# EAGLE design ATmega128 (EAGLE 5.01)
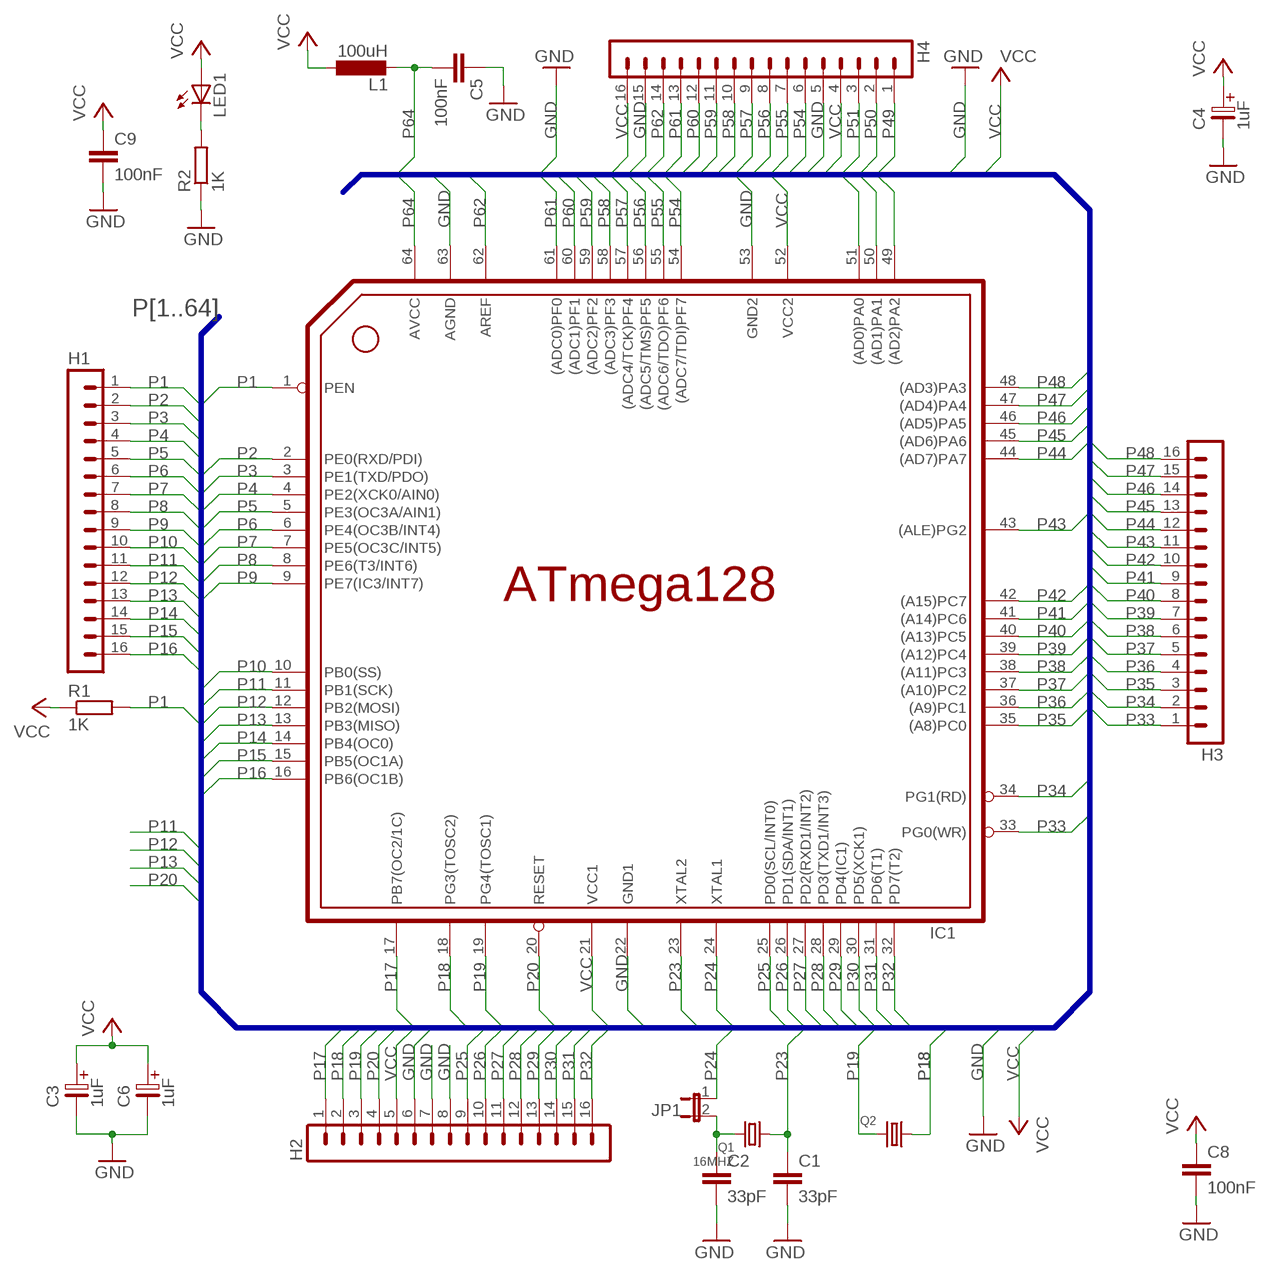
[diagram p0: schematic, sheet 1]

## Parts
C1  33pF  CAP2.5  [CAP2.5]
C2  33pF  CAP2.5  [CAP2.5]
C3  1uF  ELC2.5  [ELC2.5]
C4  1uF  ELC2.5  [ELC2.5]
C5  100nF  CAP2.5  [CAP2.5]
C6  1uF  ELC2.5  [ELC2.5]
C8  100nF  CAP2.5  [CAP2.5]
C9  100nF  CAP2.5  [CAP2.5]
H1  HEADER-16PIN  [HEADER-16PIN]
H2  HEADER-16PIN  [HEADER-16PIN]
H3  HEADER-16PIN  [HEADER-16PIN]
H4  HEADER-16PIN  [HEADER-16PIN]
IC1  ATMEGA128TQFP  [HEADER64PIN_MCU]
JP1  JP1E  [JP1]
L1  100uH  L-EU0204/7  [0204/7]
LED1  LED3MM  [LED3MM]
Q1  16MHZ  CRYSTALHC  [HC49]
Q2  CRYSTALTC  [TC26]
R1  1K  R-5-7M  [R-7]
R2  1K  R-5-7M  [R-7]

## Nets
GND: C1.2 C2.2 C3.2 C4.2 C5.1 C6.2 C8.2 C9.2 H2.6 H2.7 H2.8 H4.5 H4.15 IC1.22(GND1) IC1.53(GND2) IC1.63(AGND) R2.1
N$1: LED1.K(C) R2.2
N$66: C2.1 JP1.2 Q1.2
P1: H1.1 IC1.1(PEN) R1.2
P2: H1.2 IC1.2(PE0(RXD/PDI))
P3: H1.3 IC1.3(PE1(TXD/PDO))
P4: H1.4 IC1.4(PE2(XCK0/AIN0))
P5: H1.5 IC1.5(PE3(OC3A/AIN1))
P6: H1.6 IC1.6(PE4(OC3B/INT4))
P7: H1.7 IC1.7(PE5(OC3C/INT5))
P8: H1.8 IC1.8(PE6(T3/INT6))
P9: H1.9 IC1.9(PE7(IC3/INT7))
P10: H1.10 IC1.10(PB0(SS))
P11: H1.11 IC1.11(PB1(SCK))
P12: H1.12 IC1.12(PB2(MOSI))
P13: H1.13 IC1.13(PB3(MISO))
P14: H1.14 IC1.14(PB4(OC0))
P15: H1.15 IC1.15(PB5(OC1A))
P16: H1.16 IC1.16(PB6(OC1B))
P17: H2.1 IC1.17(PB7(OC2/1C))
P18: H2.2 IC1.18(PG3(TOSC2)) Q2.1
P19: H2.3 IC1.19(PG4(TOSC1)) Q2.2
P20: H2.4 IC1.20(RESET)
P23: C1.1 IC1.23(XTAL2) Q1.1
P24: IC1.24(XTAL1) JP1.1
P25: H2.9 IC1.25(PD0(SCL/INT0))
P26: H2.10 IC1.26(PD1(SDA/INT1))
P27: H2.11 IC1.27(PD2(RXD1/INT2))
P28: H2.12 IC1.28(PD3(TXD1/INT3))
P29: H2.13 IC1.29(PD4(IC1))
P30: H2.14 IC1.30(PD5(XCK1))
P31: H2.15 IC1.31(PD6(T1))
P32: H2.16 IC1.32(PD7(T2))
P33: H3.1 IC1.33(PG0(WR))
P34: H3.2 IC1.34(PG1(RD))
P35: H3.3 IC1.35((A8)PC0)
P36: H3.4 IC1.36((A9)PC1)
P37: H3.5 IC1.37((A10)PC2)
P38: H3.6 IC1.38((A11)PC3)
P39: H3.7 IC1.39((A12)PC4)
P40: H3.8 IC1.40((A13)PC5)
P41: H3.9 IC1.41((A14)PC6)
P42: H3.10 IC1.42((A15)PC7)
P43: H3.11 IC1.43((ALE)PG2)
P44: H3.12 IC1.44((AD7)PA7)
P45: H3.13 IC1.45((AD6)PA6)
P46: H3.14 IC1.46((AD5)PA5)
P47: H3.15 IC1.47((AD4)PA4)
P48: H3.16 IC1.48((AD3)PA3)
P49: H4.1 IC1.49((AD2)PA2)
P50: H4.2 IC1.50((AD1)PA1)
P51: H4.3 IC1.51((AD0)PA0)
P54: H4.6 IC1.54((ADC7/TDI)PF7)
P55: H4.7 IC1.55((ADC6/TDO)PF6)
P56: H4.8 IC1.56((ADC5/TMS)PF5)
P57: H4.9 IC1.57((ADC4/TCK)PF4)
P58: H4.10 IC1.58((ADC3)PF3)
P59: H4.11 IC1.59((ADC2)PF2)
P60: H4.12 IC1.60((ADC1)PF1)
P61: H4.13 IC1.61((ADC0)PF0)
P62: H4.14 IC1.62(AREF)
P64: C5.2 IC1.64(AVCC) L1.2
VCC: C3.1 C4.1 C6.1 C8.1 C9.1 H2.5 H4.4 H4.16 IC1.21(VCC1) IC1.52(VCC2) L1.1 LED1.A R1.1

## Buses
P[1..64]

## Library data of the parts
C1 C2 C5 C8 C9 = WALID2008A:CAP: Ceramic Capacitor
C3 C4 C6 = WALID2008A:ELC: Electric Capacitor
H1-H4 = WALID2008A:HEADER-16PIN: Header 16 Pin
IC1 = WALID2008A:ATMEGA128: MICROCONTROLLER 128 Kbytes FLASH 4 Kbytes SRAM 4 Kbytes EEPROM DUAL USART 8-channel 10 bit ADC
JP1 = jumper:JP1E: JUMPER
L1 = WALID2008A:L-EU: INDUCTOR, European symbol
LED1 = led:LED: LED OSRAM: - CHIPLED LG R971, LG N971, LY N971, LG Q971, LY Q971, LO R971, LY R971 LH N974, LH R974 LS Q976, LO Q976, LY Q976 LO Q996 - Hyper CHIPLED LW Q18S LB Q993, LB Q99A, LB R99A - SideLED LS A670, LO A670, LY A670, LG A670, LP A670 LB A673, LV A673, LT A673, LW A673 LH A674 LY A675 LS A676, LA A676, LO A676, LY A676, LW A676 LS A679, LY A679, LG A679 - Hyper Micro SIDELED® LS Y876, LA Y876, LO Y876, LY Y876 LT Y87S - SmartLED LW L88C, LW L88S LB L89C, LB L89S, LG L890 LS L89K, LO L89K, LY L89K LS L896, LA L896, LO L896, LY L896 - TOPLED LS T670, LO T670, LY T670, LG T670, LP T670 LSG T670, LSP T670, LSY T670, LOP T670, LYG T670 LG T671, LOG T671, LSG T671 LB T673, LV T673, LT T673, LW T673 LH T674 LS T676, LA T676, LO T676, LY T676, LB T676, LH T676, LSB T676, LW T676 LB T67C, LV T67C, LT T67C, LS T67K, LO T67K, LY T67K, LW E67C LS E67B, LA E67B, LO E67B, LY E67B, LB E67C, LV E67C, LT E67C LW T67C LS T679, LY T679, LG T679 LS T770, LO T770, LY T770, LG T770, LP T770 LB T773, LV T773, LT T773, LW T773 LH T774 LS E675, LA E675, LY E675, LS T675 LS T776, LA T776, LO T776, LY T776, LB T776 LHGB T686 LT T68C, LB T68C - Hyper Mini TOPLED® LB M676 - Mini TOPLED Santana® LG M470 LS M47K, LO M47K, LY M47K Source: http://www.osram.convergy.de - LUMILED® LXK2-PW12-R00, LXK2-PW12-S00, LXK2-PW14-U00, LXK2-PW14-V00 LXK2-PM12-R00, LXK2-PM12-S00, LXK2-PM14-U00 LXK2-PE12-Q00, LXK2-PE12-R00, LXK2-PE12-S00, LXK2-PE14-T00, LXK2-PE14-U00 LXK2-PB12-K00, LXK2-PB12-L00, LXK2-PB12-M00, LXK2-PB14-N00, LXK2-PB14-P00, LXK2-PB14-Q00 LXK2-PR12-L00, LXK2-PR12-M00, LXK2-PR14-Q00, LXK2-PR14-R00 LXK2-PD12-Q00, LXK2-PD12-R00, LXK2-PD12-S00 LXK2-PH12-R00, LXK2-PH12-S00 LXK2-PL12-P00, LXK2-PL12-Q00, LXK2-PL12-R00 Source: www.luxeon.com
Q1 Q2 = WALID2008A:CRYSTAL: Crystal
R1 R2 = WALID2008A:R-5: Resistor 5, 7,8, 10, 12, 13, 15, 17, 19, 20, 25, 28, 30mm

## Board
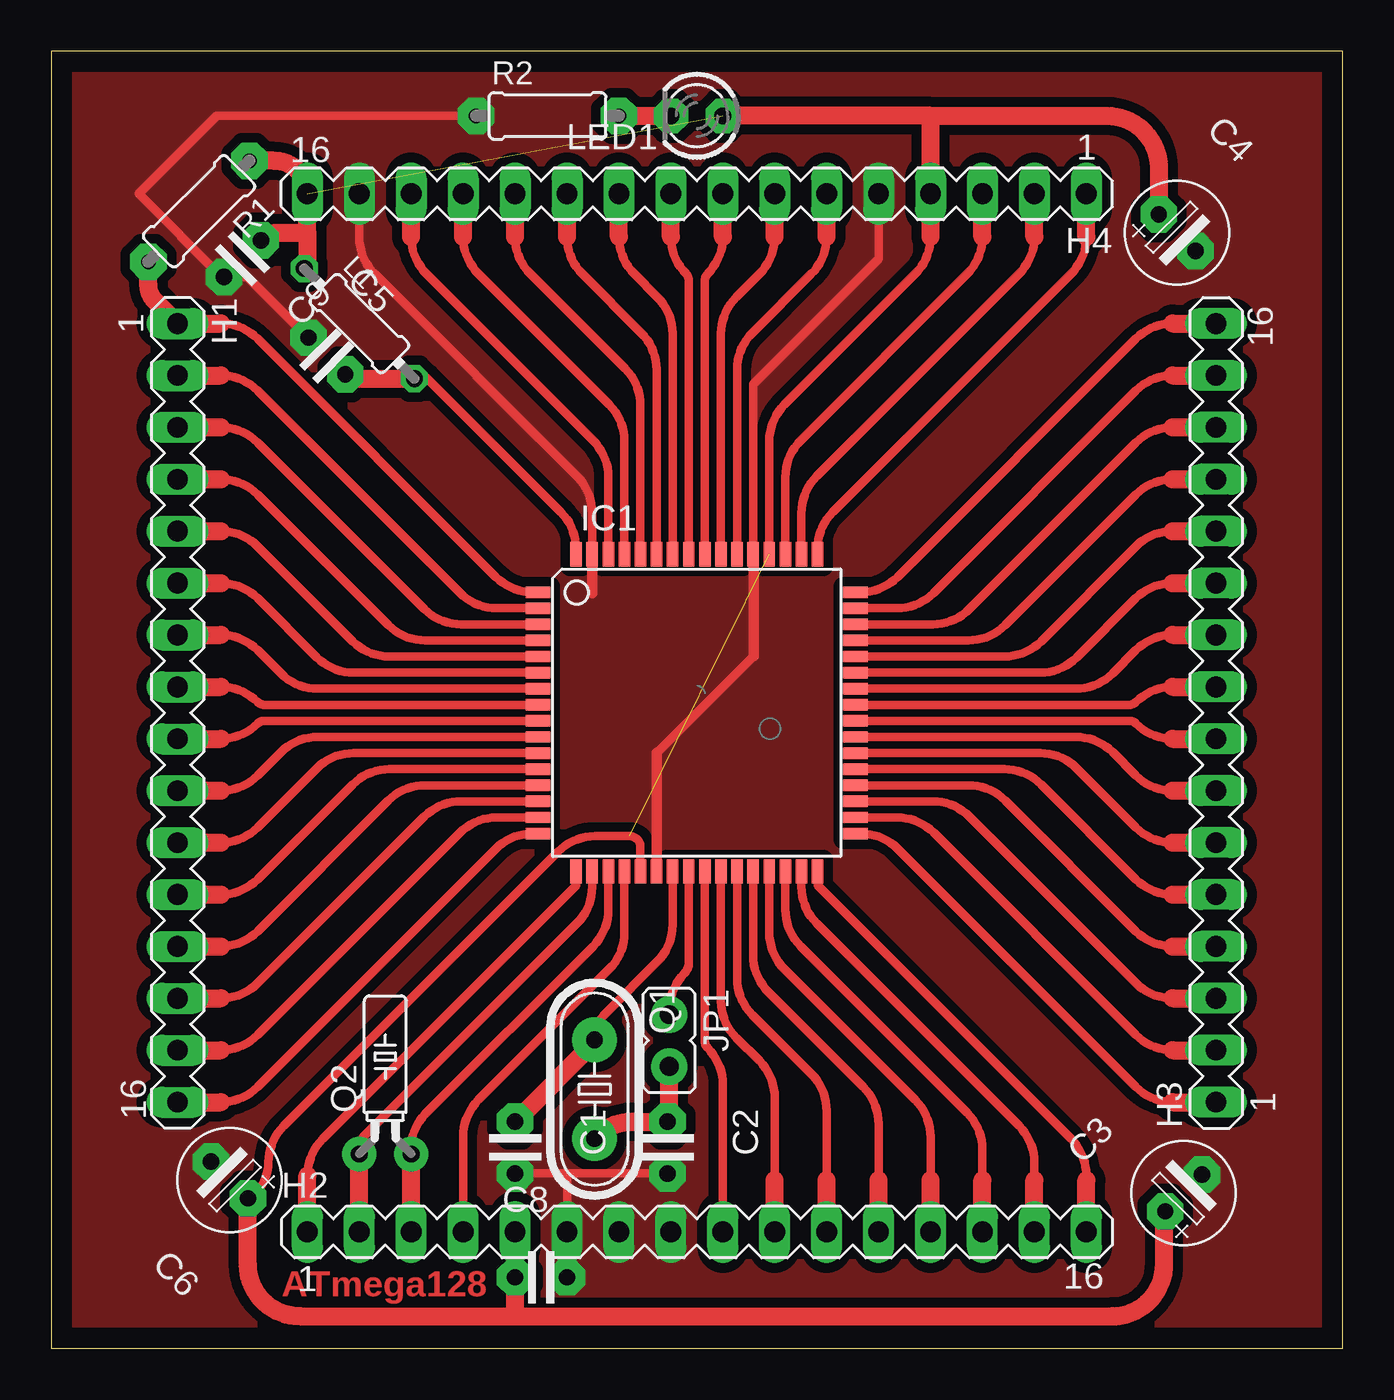
[diagram p1: board, top side]

Size 63.17 x 63.48 mm. Coordinates in mm from the lower left corner, seen from the top.
Outline: 0,63.48 0,0 63.17,0 63.17,63.48 0,63.48
Copper layers (1*16): Top 0.035mm / dielectric 1.5mm / Bottom 0.035mm
Design rules "default *": minimum track width 20mil, minimum drill 24mil, track to track 8mil, track to pad 8mil, pad to pad 8mil, via to via 8mil, smd to smd 8mil, copper to edge 40mil, drill to drill 8mil, minimum pad ring 10mil, minimum via ring 8mil, stop-mask expansion 4mil, vias tented up to drill 0mil, thermal gap 10mil

### Footprints (pad centres in the part's own frame; a part is rotated, then mirrored left to right if it is on the bottom)
CAP2.5 = drill 0.8 pad 1.778 octagon: 1 -1.27,0; 2 1.27,0
ELC2.5 = drill 0.8 pad 1.778 octagon: 1 -1.27,0; 2 1.27,0
HEADER-16PIN = drill 1.016 long: 1 -17.78,0; 2 -15.24,0; 3 -12.7,0; 4 -10.16,0; 5 -7.62,0; 6 -5.08,0; 7 -2.54,0; 8 0,0; 9 2.54,0; 10 5.08,0; 11 7.62,0; 12 10.16,0; 13 12.7,0; 14 15.24,0; 15 17.78,0; 16 20.32,0
HEADER64PIN_MCU = smd 1.194 x 0.559: 1 -7.76,5.905; 2 -7.76,5.118; 3 -7.76,4.331; 4 -7.76,3.543; 5 -7.76,2.756; 6 -7.76,1.968; 7 -7.76,1.181; 8 -7.76,0.394; 9 -7.76,-0.394; 10 -7.76,-1.181; 11 -7.76,-1.968; 12 -7.76,-2.756; 13 -7.76,-3.543; 14 -7.76,-4.331; 15 -7.76,-5.118; 16 -7.76,-5.905; 33 7.76,-5.905; 34 7.76,-5.118; 35 7.76,-4.331; 36 7.76,-3.543; 37 7.76,-2.756; 38 7.76,-1.968; 39 7.76,-1.181; 40 7.76,-0.394; 41 7.76,0.394; 42 7.76,1.181; 43 7.76,1.968; 44 7.76,2.756; 45 7.76,3.543; 46 7.76,4.331; 47 7.76,5.118; 48 7.76,5.905 | smd 0.559 x 1.194: 17 -5.905,-7.76; 18 -5.118,-7.76; 19 -4.331,-7.76; 20 -3.543,-7.76; 21 -2.756,-7.76; 22 -1.968,-7.76; 23 -1.181,-7.76; 24 -0.394,-7.76; 25 0.394,-7.76; 26 1.181,-7.76; 27 1.968,-7.76; 28 2.756,-7.76; 29 3.543,-7.76; 30 4.331,-7.76; 31 5.118,-7.76; 32 5.905,-7.76; 49 5.905,7.76; 50 5.118,7.76; 51 4.331,7.76; 52 3.543,7.76; 53 2.756,7.76; 54 1.968,7.76; 55 1.181,7.76; 56 0.394,7.76; 57 -0.394,7.76; 58 -1.181,7.76; 59 -1.968,7.76; 60 -2.756,7.76; 61 -3.543,7.76; 62 -4.331,7.76; 63 -5.118,7.76; 64 -5.905,7.76
JP1 = drill 0.914 pad 1.778 round: 1 0,-1.27; 2 0,1.27
0204/7 = drill 0.813 octagon: 1 -3.81,0; 2 3.81,0
LED3MM = drill 0.813 pad 1.676 octagon: A -1.27,0; K 1.27,0
HC49 = drill 0.813 pad 2.184 round: 1 -2.413,0; 2 2.413,0
TC26 = drill 0.813 pad 1.676 round: 1 -1.27,-5.08; 2 1.27,-5.08
R-7 = drill 0.7 pad 1.778 octagon: 1 -3.175,0; 2 3.81,0

### Placement (x,y rotation side)
C1  22.69,9.83 270 top
C2  30.16,9.83 270 top
C3  55.4,7.6 45 top
C4  55.08,54.59 315 top
C5  13.49,48.56 315 top
C6  8.72,8.24 135 top
C8  23.97,3.48 0 top
C9  9.36,53.33 225 top
H1  6.19,32.37 270 top
H2  30.31,5.7 0 top
H3  56.98,29.83 90 top
H4  32.86,56.5 180 top
IC1  31.58,31.1 0 top
JP1  30.24,15.07 180 top
L1  15.08,50.15 315 top
LED1  31.58,60.31 180 top
Q1  26.58,12.69 270 top
Q2  16.34,14.59 0 top
R1  7.45,55.86 225 top
R2  23.97,60.31 0 top

### Tracks (layer width: path | path; a pad name or v marks a point on that pad's centre or on a via)
GND
  Top 0.406: H4.5 40.47,53.33 34.34,47.19 IC1.53 34.34,38.74 34.36,38.72 | C1.2 25.23,8.56 | 25.23,8.56 C2.2 30.31,8.56 | 25.23,8.56 H2.6 | 29.62,29.13 34.36,33.88 | C5.1 9.62,52.43 C9.2 8.35,52.43 4.28,56.5 8.09,60.31 R2.1 | IC1.63 26.47,38.98 26.47,40.88 arc45 25.72,42.68 15.82,52.58 arc-45 15.08,54.38 H4.15
  Top 0.508: IC1.22 29.62,29.13 | 34.36,33.88 34.36,38.72 | 26.47,36.95 26.47,38.98
  pour Top (isolate 0.483, no thermals): -0.8,66.34 68.41,66.34 68.41,-0.97 -0.8,-0.97
N$1
  Top 0.889: R2.2 LED1.K
N$66
  Top 0.406: JP1.2 30.19,13.75 30.24,13.7 | C2.1 30.24,11.1
  Top 0.889: 30.24,11.1 30.24,13.7 | Q1.2 26.58,10.3 26.63,10.35 arc-45 28.43,11.1 C2.1
P1
  Top 0.406: 8.31,50.15 arc-45 10.1,49.41 21.76,37.75 arc45 23.56,37.01 IC1.1 | R1.2
  Top 0.889: 8.31,50.15 H1.1 5.08,51.25 arc-45 4.76,52.04 R1.2
P2
  Top 0.406: 8.31,47.61 arc-45 10.1,46.87 20.01,36.96 arc45 21.8,36.22 IC1.2
  Top 0.889: H1.2 8.31,47.61
P3
  Top 0.406: 8.31,45.07 arc-45 10.1,44.33 18.25,36.17 arc45 20.05,35.43 IC1.3
  Top 0.889: H1.3 8.31,45.07
P4
  Top 0.406: 8.31,42.53 arc-45 10.1,41.79 16.5,35.39 arc45 18.3,34.64 IC1.4
  Top 0.889: H1.4 8.31,42.53
P5
  Top 0.406: 8.31,39.99 arc-45 10.1,39.25 14.75,34.6 arc45 16.55,33.86 IC1.5
  Top 0.889: H1.5 8.31,39.99
P6
  Top 0.406: 8.31,37.45 arc-45 10.1,36.71 13,33.81 arc45 14.79,33.07 IC1.6
  Top 0.889: H1.6 8.31,37.45
P7
  Top 0.406: 8.31,34.91 arc-45 10.1,34.17 11.25,33.02 arc45 13.04,32.28 IC1.7
  Top 0.889: H1.7 8.31,34.91
P8
  Top 0.406: 8.31,32.37 arc-45 10.1,31.63 arc45 10.42,31.49 IC1.8
  Top 0.889: H1.8 8.31,32.37
P9
  Top 0.406: 8.31,29.83 arc45 10.1,30.57 arc-45 10.42,30.71 IC1.9
  Top 0.889: H1.9 8.31,29.83
P10
  Top 0.406: 8.31,27.29 arc45 10.1,28.03 11.25,29.17 arc-45 13.04,29.92 IC1.10
  Top 0.889: H1.10 8.31,27.29
P11
  Top 0.406: 8.31,24.75 arc45 10.1,25.49 13,28.39 arc-45 14.79,29.13 IC1.11
  Top 0.889: H1.11 8.31,24.75
P12
  Top 0.406: 8.31,22.21 arc45 10.1,22.95 14.75,27.6 arc-45 16.55,28.34 IC1.12
  Top 0.889: H1.12 8.31,22.21
P13
  Top 0.406: 8.31,19.67 arc45 10.1,20.41 16.5,26.81 arc-45 18.3,27.56 IC1.13
  Top 0.889: H1.13 8.31,19.67
P14
  Top 0.406: 8.31,17.13 arc45 10.1,17.87 18.25,26.02 arc-45 20.05,26.77 IC1.14
  Top 0.889: H1.14 8.31,17.13
P15
  Top 0.406: 8.31,14.59 arc45 10.1,15.33 20.01,25.24 arc-45 21.8,25.98 IC1.15
  Top 0.889: H1.15 8.31,14.59
P16
  Top 0.406: 8.31,12.05 arc45 10.1,12.79 21.76,24.45 arc-45 23.56,25.2 IC1.16
  Top 0.889: H1.16 8.31,12.05
P17
  Top 0.406: IC1.17 25.68,22.66 13.28,10.25 arc45 12.53,8.46
  Top 0.889: H2.1 12.53,8.46
P18
  Top 0.406: IC1.18 26.47,22.59 arc-45 25.72,20.79 15.3,10.37 arc45 15.08,9.83
  Top 0.889: H2.2 Q2.1
  Top 1.016: Q2.1 15.08,9.83
P19
  Top 0.406: 17.61,9.83 arc-45 18.29,11.45 26.51,19.67 arc45 27.25,21.47 IC1.19
  Top 0.889: H2.3 Q2.2
  Top 1.016: Q2.2 17.61,9.83
P20
  Top 0.406: H2.4 20.16,10.36 arc-45 20.9,12.16 27.3,18.56 arc45 28.04,20.35 IC1.20
P23
  Top 0.406: Q1.1 26.58,15.07 | Q1.1 | IC1.23 30.4,20.73 arc-45 29.66,18.94 27.12,16.4 arc45 Q1.1 | 26.58,14.99 Q1.1
  Top 0.889: C1.1 26.58,14.99
P24
  Top 0.406: JP1.1 30.24,16.55 arc-45 30.98,18.35 arc45 31.19,18.86 IC1.24
P25
  Top 0.406: H2.9 32.86,12.9 arc45 32.11,14.7 arc-45 31.98,15.02 IC1.25
P26
  Top 0.406: 35.39,8.24 35.39,12.27 arc45 34.65,14.06 33.51,15.21 arc-45 32.77,17 IC1.26
  Top 0.889: H2.10 35.39,8.24
P27
  Top 0.406: 37.94,8.24 37.94,11.63 arc45 37.19,13.43 34.3,16.32 arc-45 33.55,18.12 IC1.27
  Top 0.889: H2.11 37.94,8.24
P28
  Top 0.406: 40.47,8.24 40.47,11 arc45 39.73,12.79 35.08,17.44 arc-45 34.34,19.24 IC1.28
  Top 0.889: H2.12 40.47,8.24
P29
  Top 0.406: 43.02,8.24 43.02,10.36 arc45 42.27,12.16 35.87,18.56 arc-45 35.13,20.35 IC1.29
  Top 0.889: H2.13 43.02,8.24
P30
  Top 0.406: 45.55,8.24 45.55,9.73 arc45 44.81,11.52 36.66,19.67 arc-45 35.92,21.47 IC1.30
  Top 0.889: H2.14 45.55,8.24
P31
  Top 0.406: 48.09,8.24 48.09,9.09 arc45 47.35,10.89 37.45,20.79 arc-45 36.7,22.59 IC1.31
  Top 0.889: H2.15 48.09,8.24
P32
  Top 0.406: IC1.32 37.49,22.66 49.89,10.25 arc-45 50.63,8.46 50.63,8.24
  Top 0.889: H2.16 50.63,8.24
P33
  Top 0.406: IC1.33 39.61,25.2 arc-45 41.41,24.45 53.07,12.79 arc45 54.86,12.05
  Top 0.889: 54.86,12.05 H3.1
P34
  Top 0.406: IC1.34 41.37,25.98 arc-45 43.16,25.24 53.07,15.33 arc45 54.86,14.59
  Top 0.889: 54.86,14.59 H3.2
P35
  Top 0.406: IC1.35 43.12,26.77 arc-45 44.91,26.02 53.07,17.87 arc45 54.86,17.13
  Top 0.889: 54.86,17.13 H3.3
P36
  Top 0.406: IC1.36 44.87,27.56 arc-45 46.67,26.81 53.07,20.41 arc45 54.86,19.67
  Top 0.889: 54.86,19.67 H3.4
P37
  Top 0.406: IC1.37 46.62,28.34 arc-45 48.42,27.6 53.07,22.95 arc45 54.86,22.21
  Top 0.889: 54.86,22.21 H3.5
P38
  Top 0.406: IC1.38 48.38,29.13 arc-45 50.17,28.39 53.07,25.49 arc45 54.86,24.75
  Top 0.889: 54.86,24.75 H3.6
P39
  Top 0.406: IC1.39 50.13,29.92 arc-45 51.92,29.17 53.07,28.03 arc45 54.86,27.29
  Top 0.889: 54.86,27.29 H3.7
P40
  Top 0.406: IC1.40 52.75,30.71 arc-45 53.07,30.57 arc45 54.86,29.83
  Top 0.889: 54.86,29.83 H3.8
P41
  Top 0.406: IC1.41 52.75,31.49 arc45 53.07,31.63 arc-45 54.86,32.37
  Top 0.889: 54.86,32.37 H3.9
P42
  Top 0.406: IC1.42 50.13,32.28 arc45 51.92,33.02 53.07,34.17 arc-45 54.86,34.91
  Top 0.889: 54.86,34.91 H3.10
P43
  Top 0.406: IC1.43 48.38,33.07 arc45 50.17,33.81 53.07,36.71 arc-45 54.86,37.45
  Top 0.889: 54.86,37.45 H3.11
P44
  Top 0.406: IC1.44 46.62,33.86 arc45 48.42,34.6 53.07,39.25 arc-45 54.86,39.99
  Top 0.889: 54.86,39.99 H3.12
P45
  Top 0.406: IC1.45 44.87,34.64 arc45 46.67,35.39 53.07,41.79 arc-45 54.86,42.53
  Top 0.889: 54.86,42.53 H3.13
P46
  Top 0.406: IC1.46 43.12,35.43 arc45 44.91,36.17 53.07,44.33 arc-45 54.86,45.07
  Top 0.889: 54.86,45.07 H3.14
P47
  Top 0.406: IC1.47 41.37,36.22 arc45 43.16,36.96 53.07,46.87 arc-45 54.86,47.61
  Top 0.889: 54.86,47.61 H3.15
P48
  Top 0.406: IC1.48 39.61,37.01 arc45 41.41,37.75 53.07,49.41 arc-45 54.86,50.15
  Top 0.889: 54.86,50.15 H3.16
P49
  Top 0.406: IC1.49 37.49,39.13 arc-45 38.23,40.92 49.89,52.58 arc45 50.63,54.38
  Top 0.889: 50.63,54.38 H4.1
P50
  Top 0.406: IC1.50 36.7,40.88 arc-45 37.45,42.68 47.35,52.58 arc45 48.09,54.38
  Top 0.889: 48.09,54.38 H4.2
P51
  Top 0.406: IC1.51 35.92,42.63 arc-45 36.66,44.43 44.81,52.58 arc45 45.55,54.38
  Top 0.889: 45.55,54.38 H4.3
P54
  Top 0.406: IC1.54 33.55,47.89 arc-45 34.3,49.69 37.19,52.58 arc45 37.94,54.38
  Top 0.889: 37.94,54.38 H4.6
P55
  Top 0.406: IC1.55 32.77,49.64 arc-45 33.51,51.44 34.65,52.58 arc45 35.39,54.38
  Top 0.889: 35.39,54.38 H4.7
P56
  Top 0.406: IC1.56 31.98,52.26 arc-45 32.11,52.58 arc45 32.86,54.38
  Top 0.889: 32.86,54.38 H4.8
P57
  Top 0.406: IC1.57 31.19,52.26 arc45 31.06,52.58 arc-45 30.31,54.38
  Top 0.889: 30.31,54.38 H4.9
P58
  Top 0.406: IC1.58 30.4,49.64 arc45 29.66,51.44 28.52,52.58 arc-45 27.77,54.38
  Top 0.889: 27.77,54.38 H4.10
P59
  Top 0.406: IC1.59 29.62,47.89 arc45 28.87,49.69 25.98,52.58 arc-45 25.23,54.38
  Top 0.889: 25.23,54.38 H4.11
P60
  Top 0.406: IC1.60 28.83,46.14 arc45 28.08,47.93 23.44,52.58 arc-45 22.69,54.38
  Top 0.889: 22.69,54.38 H4.12
P61
  Top 0.406: IC1.61 28.04,44.39 arc45 27.3,46.18 20.9,52.58 arc-45 20.16,54.38
  Top 0.889: 20.16,54.38 H4.13
P62
  Top 0.406: IC1.62 27.25,42.63 arc45 26.51,44.43 18.36,52.58 arc-45 17.61,54.38
  Top 0.889: 17.61,54.38 H4.14
P64
  Top 0.406: L1.2 17.86,47.53 18.33,47.53 24.94,40.92 arc-45 25.68,39.13 IC1.64 | 14.59,47.46 C5.2
  Top 0.889: C5.2 | 14.59,47.46 L1.2
VCC  (2 unrouted)
  Top 0.406: IC1.52 35.13,44.39 arc-45 35.87,46.18 42.27,52.58 arc45 43.02,54.38 | IC1.21 28.83,24.54 arc90 28.3,25.07 26.61,25.07 arc45 24.81,24.32 11.37,10.89 arc45 10.63,9.09 arc-45 10.03,7.64 9.68,7.29 C6.1 | C6.1 | 54.44,6.71 C3.1
  Top 0.889: 43.02,54.38 H4.4 43.02,60.31 | 22.69,1.57 C8.1 | C8.1 H2.5 C8.1 | C6.1 9.62,4.11 arc90 12.16,1.57 22.69,1.57 | 43.02,60.31 51.64,60.31 arc-90 54.18,57.77 C4.1 | 43.02,60.31 LED1.A | 22.69,1.57 51.91,1.57 arc90 54.44,4.11 54.44,6.71 | L1.1 arc45 12.53,53.22 12.53,54.59 | 12.53,54.59 H4.16 arc90 10.92,58.11 R1.1 | C9.1 arc-45 11.16,54.59 12.53,54.59

### Text on the board
Top: ATmega128